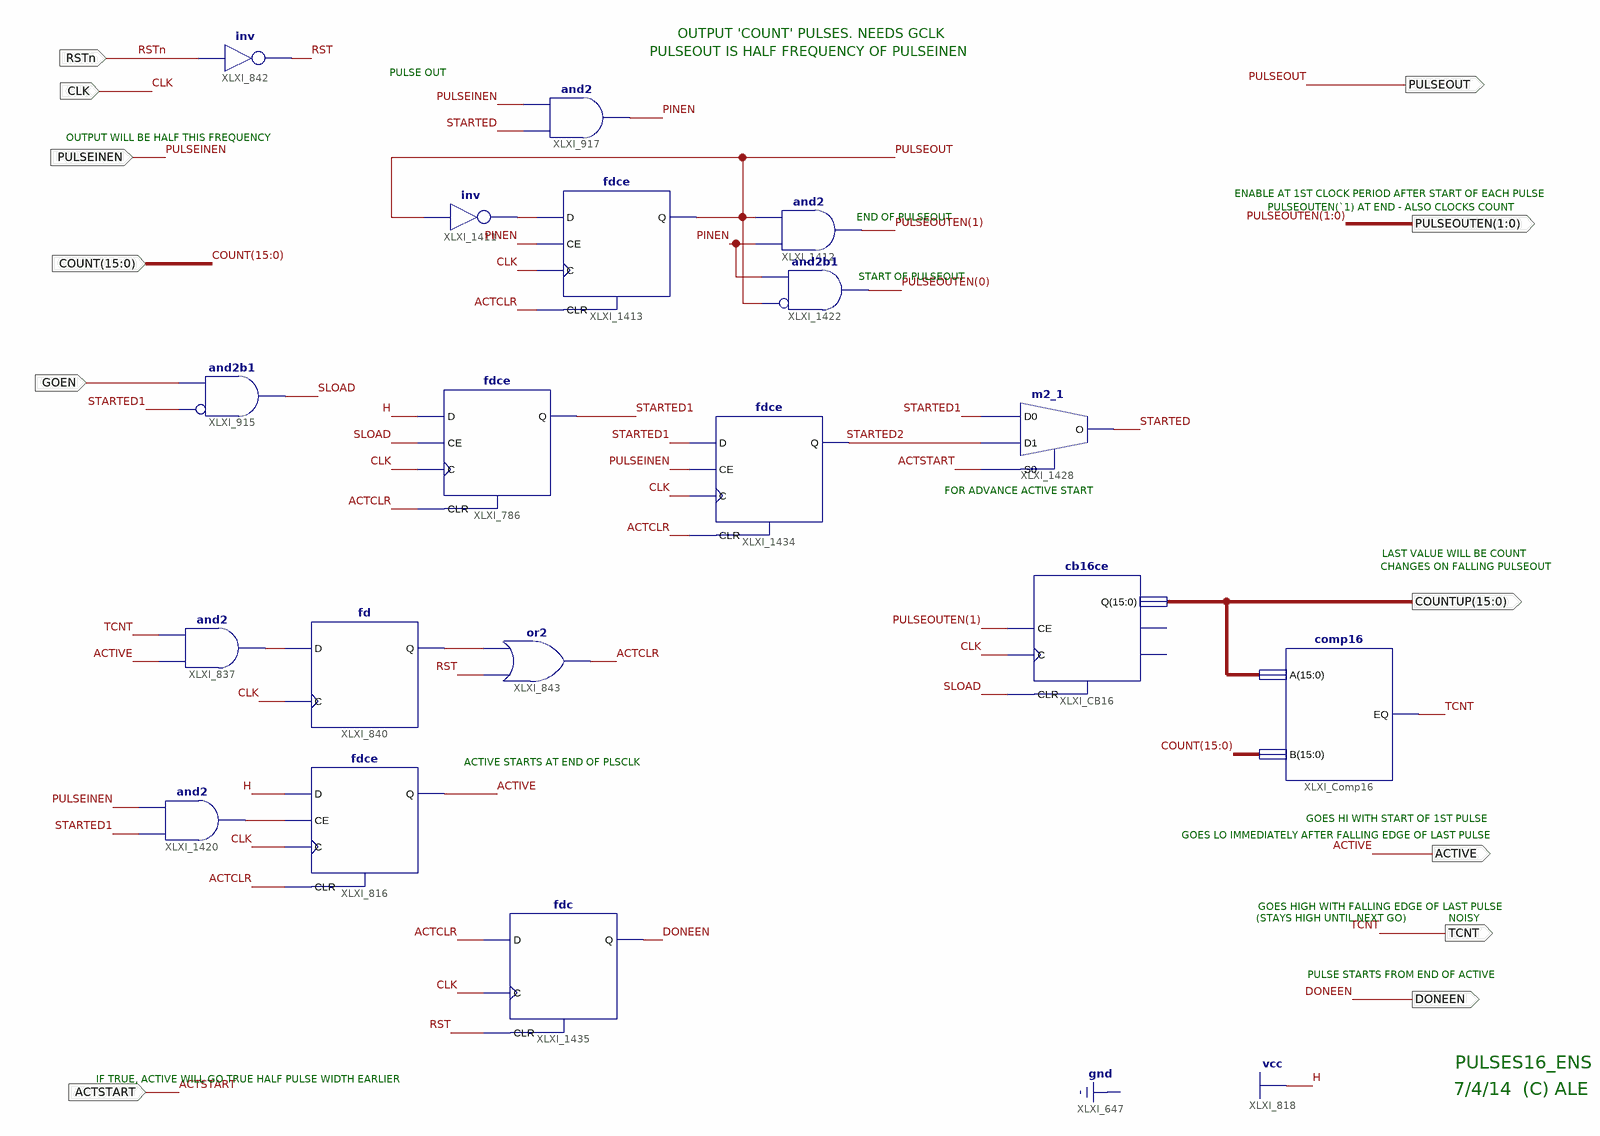
[diagram p0: schematic sheet 1]
// Xilinx ISE schematic Pulses16_Ens.sch (spartan3e) as structural Verilog: 18 symbols, 13 ports
module Pulses16_Ens (
  input  RSTn,
  input  CLK,
  input  [15:0] COUNT,
  input  GOEN,
  input  PULSEINEN,
  input  ACTSTART,
  output ACTIVE,
  output TCNT,
  output PULSEOUT,
  output [1:0] PULSEOUTEN,
  output [15:0] COUNTUP,
  output DONEEN
);

  wire ACTCLR, PINEN, RST, SLOAD, STARTED, STARTED1, STARTED2, XLXN_46, XLXN_394, XLXN_424, XLXN_611;

  not XLXI_842 (RST, RSTn);
  and XLXI_837 (XLXN_394, ACTIVE, TCNT);
  fdce XLXI_816 (.C(CLK), .CE(XLXN_611), .CLR(ACTCLR), .D(1'b1), .Q(ACTIVE));
  or XLXI_843 (ACTCLR, RST, XLXN_424);
  fd XLXI_840 (.C(CLK), .D(XLXN_394), .Q(XLXN_424));
  fdce XLXI_786 (.C(CLK), .CE(SLOAD), .CLR(ACTCLR), .D(1'b1), .Q(STARTED1));
  cb16ce XLXI_CB16 (.C(CLK), .CE(PULSEOUTEN[1]), .CLR(SLOAD), .Q(COUNTUP));  // open: CEO, TC
  comp16 XLXI_Comp16 (.A(COUNTUP), .B(COUNT), .EQ(TCNT));
  and XLXI_915 (SLOAD, ~STARTED1, GOEN);  // and2b1
  not XLXI_1411 (XLXN_46, PULSEOUT);
  fdce XLXI_1413 (.C(CLK), .CE(PINEN), .CLR(ACTCLR), .D(XLXN_46), .Q(PULSEOUT));
  and XLXI_917 (PINEN, STARTED, PULSEINEN);
  and XLXI_1412 (PULSEOUTEN[1], PINEN, PULSEOUT);
  and XLXI_1420 (XLXN_611, STARTED1, PULSEINEN);
  and XLXI_1422 (PULSEOUTEN[0], ~PULSEOUT, PINEN);  // and2b1
  m2_1 XLXI_1428 (.D0(STARTED1), .D1(STARTED2), .S0(ACTSTART), .O(STARTED));
  fdce XLXI_1434 (.C(CLK), .CE(PULSEINEN), .CLR(ACTCLR), .D(STARTED1), .Q(STARTED2));
  fdc XLXI_1435 (.C(CLK), .CLR(RST), .D(ACTCLR), .Q(DONEEN));

  // Notes on the sheet:
  //   OUTPUT 'COUNT' PULSES. NEEDS GCLK
  //   PULSEOUT IS HALF FREQUENCY OF PULSEINEN
  //   PULSE OUT
  //   OUTPUT WILL BE HALF THIS FREQUENCY
  //   ENABLE AT 1ST CLOCK PERIOD AFTER START OF EACH PULSE
  //   PULSEOUTEN(`1) AT END - ALSO CLOCKS COUNT
  //   END OF PULSEOUT
  //   START OF PULSEOUT
  //   FOR ADVANCE ACTIVE START
  //   LAST VALUE WILL BE COUNT
  //   CHANGES ON FALLING PULSEOUT
  //   ACTIVE STARTS AT END OF PLSCLK
  //   GOES HI WITH START OF 1ST PULSE
  //   GOES LO IMMEDIATELY AFTER FALLING EDGE OF LAST PULSE
  //   GOES HIGH WITH FALLING EDGE OF LAST PULSE
  //   (STAYS HIGH UNTIL NEXT GO)
  //   NOISY
  //   PULSE STARTS FROM END OF ACTIVE
  //   PULSES16_ENS
  //   IF TRUE, ACTIVE WILL GO TRUE HALF PULSE WIDTH EARLIER
  //   7/4/14  (C) ALE
endmodule
